# Altium project pulser.PrjPcb
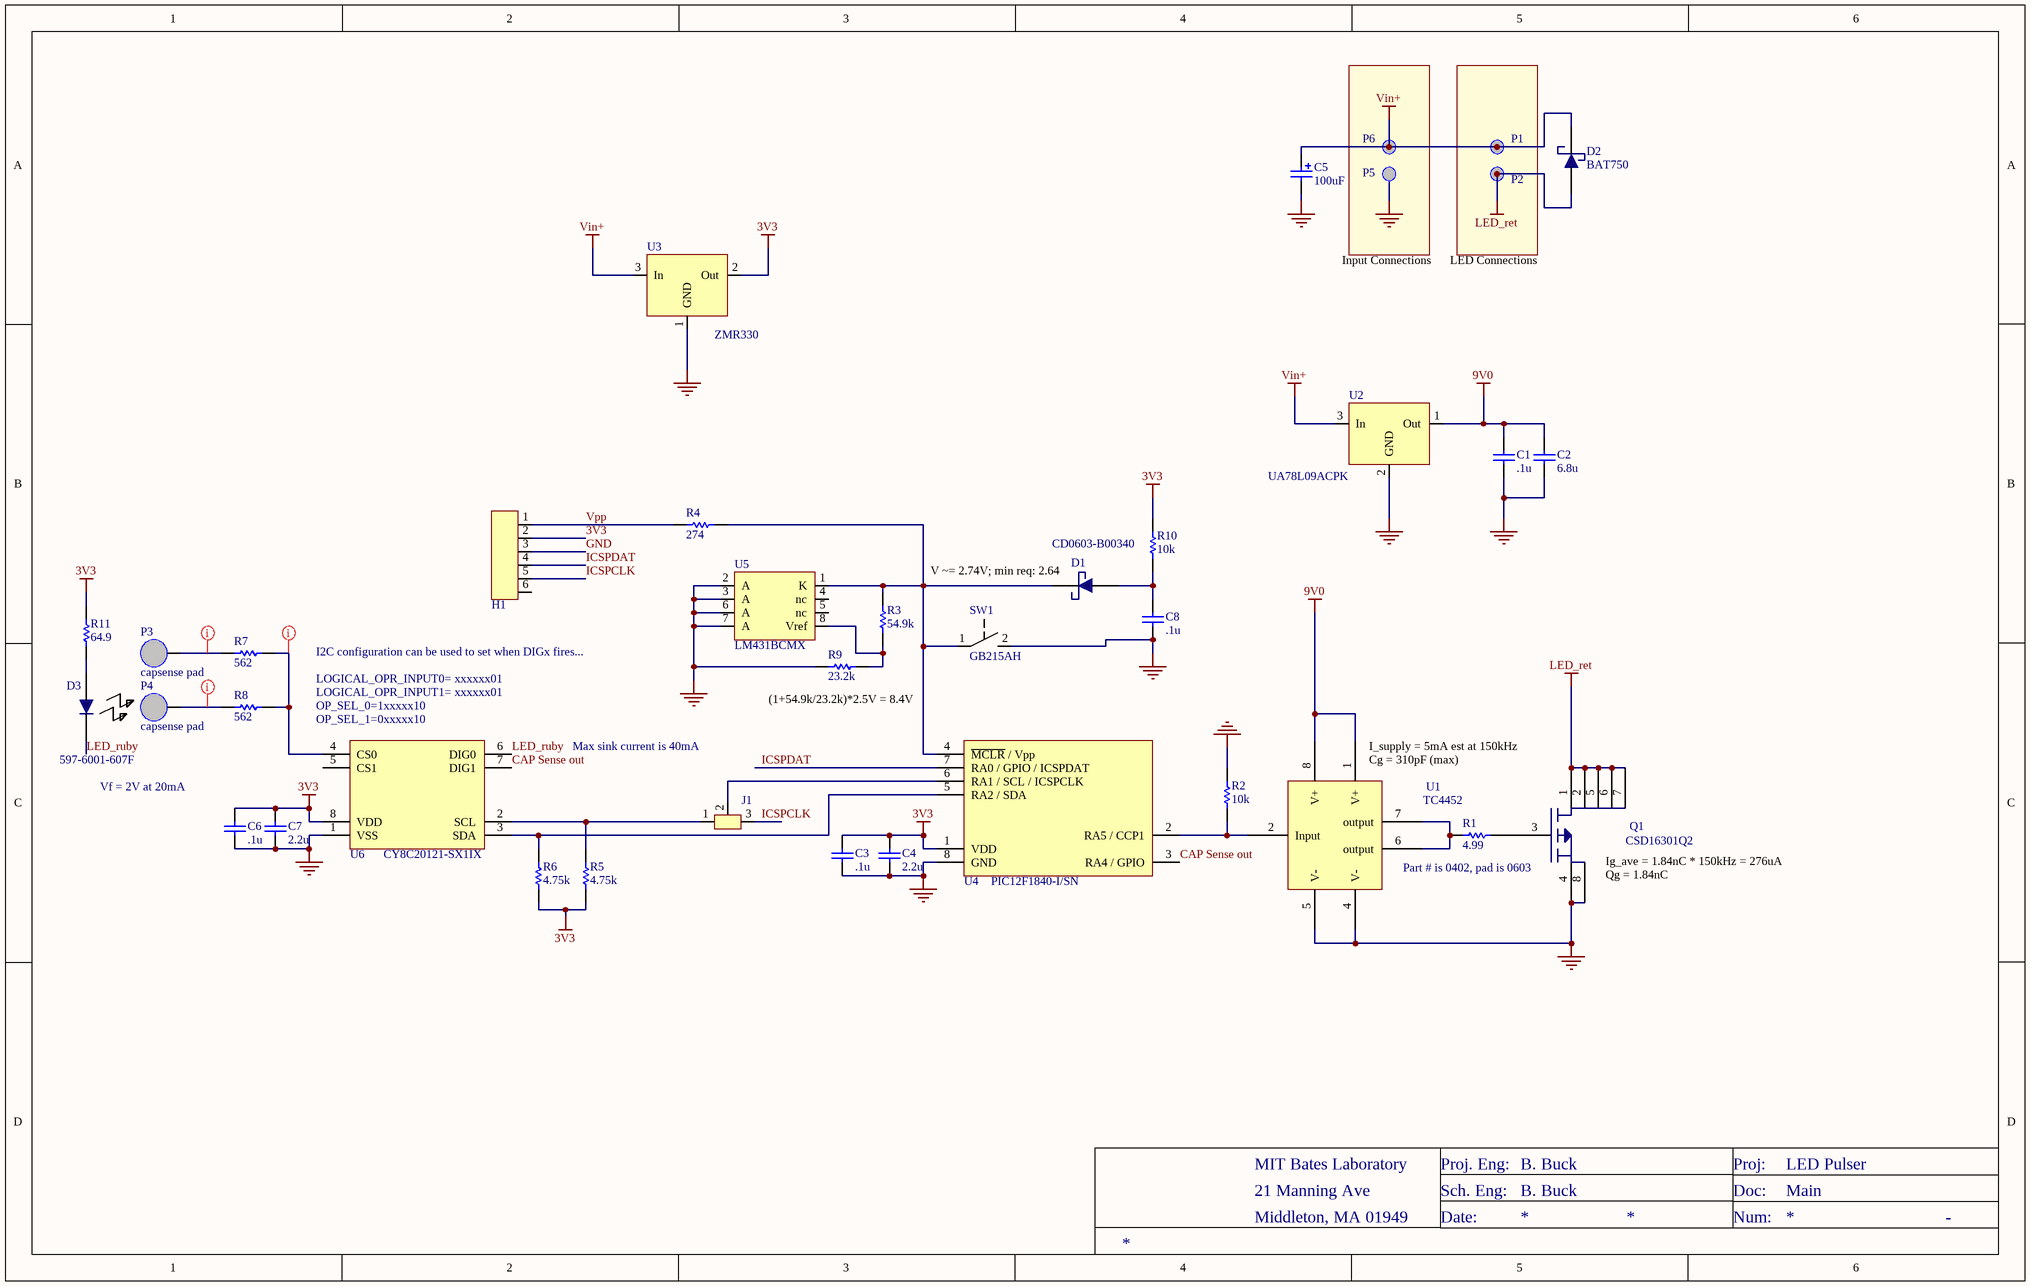
[diagram p0: pulser one pad.SchDoc]
ProjectEngineer: B. Buck; ProjectTitle: LED Pulser
1 sheet, 38 parts. Net scope: global (net labels, ports and power ports of the same name join across sheets).
Board file: pulser one pad.PcbDoc

## Sheet pulser one pad.SchDoc: Main
size 379 x 240 mm; Engineer: B. Buck; Revision: -; SheetNumber: 1; SheetTotal: 1

### Parts
C1  value .1u  [SMD0603]  (hidden comment: Cap)
C2  value 6.8u  [SMD1812]  (hidden comment: Cap)
C3  value .1u  [SMD0603]  (hidden comment: Cap)
C4  value 2.2u  [SMD0603]  (hidden comment: Cap)
C5  value 100uF  [Tant Cap Size D]  (hidden comment: CapPol)
C6  value .1u  [SMD0603]  (hidden comment: Cap)
C7  value 2.2u  [SMD0603]  (hidden comment: Cap)
C8  value .1u  [SMD0603]  (hidden comment: Cap)
D1  CD0603-B00340  [SMD0603 Polarized]
D2  BAT750  [SOT23 - Diodes]
D3  597-6001-607F  [SMD1206 Rev Mount LED]
H1  6 pin header  [6 pin header]  (value not drawn)  (no BOM)
J1  jumper  [3 PIN HEADER]  (value not drawn)  (no BOM)
P1  16AWG Solder Point  [16 AWG Solder Point]  (value not drawn)  (net tie, no BOM)
P2  16AWG Solder Point  [16 AWG Solder Point]  (value not drawn)  (net tie, no BOM)
P3  capsense pad  [CAPSENSE RUBY]  (net tie, no BOM)
P4  capsense pad  [capsense ruby 5.9mm]
P5  16AWG Solder Point  [16 AWG Solder Point]  (value not drawn)  (net tie, no BOM)
P6  16AWG Solder Point  [16 AWG Solder Point]  (value not drawn)  (net tie, no BOM)
Q1  CSD16301Q2  [CSD16301Q2]
R1  value 4.99  [SMD0603]  (hidden comment: Res)
R2  value 10k  [SMD0603]  (hidden comment: Res)
R3  value 54.9k  [SMD0603]  (hidden comment: Res)
R4  value 274  [SMD0603]  (hidden comment: Res)
R5  value 4.75k  [SMD0603]  (hidden comment: Res)
R6  value 4.75k  [SMD0603]  (hidden comment: Res)
R7  value 562  [SMD0603]  (hidden comment: Res)
R8  value 562  [SMD0603]  (hidden comment: Res)
R9  value 23.2k  [SMD0603]  (hidden comment: Res)
R10  value 10k  [SMD0603]  (hidden comment: Res)
R11  value 64.9  [SMD0603]  (hidden comment: Res)
SW1  GB215AH  [GB215AH]
U1  TC4452  [8 PIN SOIC]
U2  UA78L09ACPK  [SOT89-150P350X160-3N]
U3  ZMR330  [SOT23 - Diodes]
U4  PIC12F1840-I/SN  [8 PIN SOIC]
U5  LM431BCMX  [8 PIN SOIC]
U6  PartNumber: CY8C20121-SX1IX  [8 PIN SOIC]  (hidden comment: CY8C20121-SX1I)

### Nets
3V3: C3.2 C4.2 C6.2 C7.2 H1.2 R5.2 R6.2 R10.1 R11.2 U3.2(Out) U4.1(VDD) U6.8(VDD)
9V0: C1.2 C2.2 U1.1(V+) U1.8(V+) U2.1(Out)
GND: C1.1 C2.1 C3.1 C4.1 C5.2 C6.1 C7.1 C8.1 H1.3 P5.1 Q1.4 Q1.8 R2.2 R9.2 SW1.2 U1.4(V-) U1.5(V-) U2.2(GND) U3.1(GND) U4.8(GND) U5.2(A) U5.3(A) U5.6(A) U5.7(A) U6.1(VSS)
LED_ret: D2.2(A) P2.1 Q1.1 Q1.2 Q1.5 Q1.6 Q1.7
Vin+: C5.1 D2.1(K) P1.1 P6.1 U2.3(In) U3.3(In)
CAP Sense out: U4.3(RA4_/_GPIO) U6.7(DIG1)
ICSPCLK: H1.5 J1.3
ICSPDAT: H1.4 U4.7(RA0_/_GPIO_/_ICSPDAT)
LED_ruby: D3.K U6.6(DIG0)
Vpp: H1.1 R4.2
NetC8_2: C8.2 D1.2(A) R10.2
NetD1_1: D1.1(K) R3.2 R4.1 SW1.1 U4.4(~{MCLR}_/_Vpp) U5.1(K)
NetD3_A: D3.A R11.1
NetJ1_1: J1.1 R5.1 U6.2(SCL)
NetJ1_2: J1.2 U4.6(RA1_/_SCL_/_ICSPCLK)
NetP3_1: P3.1 R7.2
NetP4_1: P4.1 R8.2
NetQ1_3: Q1.3 R1.1
NetR1_2: R1.2 U1.6(output) U1.7(output)
NetR2_1: R2.1 U1.2(Input) U4.2(RA5_/_CCP1)
NetR3_1: R3.1 R9.1 U5.8(Vref)
NetR6_1: R6.1 U4.5(RA2_/_SDA) U6.3(SDA)
NetR7_1: R7.1 R8.1 U6.4(CS0)

Not connected (* = marked no-connect by the designer): H1 6; U5 4(nc) 5(nc); U6 5(CS1)

### Layout directives
net class capsense: NetP3_1, NetP4_1, NetR7_1

### Notes on the sheet
- Input Connections
- LED Connections
- (near D1) V ~= 2.74V; min req: 2.64
- I2C configuration can be used to set when DIGx fires...
- LOGICAL_OPR_INPUT0= xxxxxx01
- LOGICAL_OPR_INPUT1= xxxxxx01
- OP_SEL_0=1xxxxx10
- (near U6) OP_SEL_1=0xxxxx10
- Max sink current is 40mA
- (near R9) (1+54.9k/23.2k)*2.5V = 8.4V
- (near U1) Cg = 310pF (max)
- (near U1) I_supply = 5mA est at 150kHz
- Vf = 2V at 20mA
- (near Q1) Part # is 0402, pad is 0603
- (near Q1) Qg = 1.84nC
- (near Q1) Ig_ave = 1.84nC * 150kHz = 276uA
- MIT Bates Laboratory
- Proj. Eng:
- Proj:
- 21 Manning Ave
- Middleton, MA 01949
- Sch. Eng:
- Date:
- Doc:
- Num:

### Library data of the parts
C1 C3 C6 C8 = Cap: Capacitor; PartNumber: 250R14W104KV4T; Manufacturer: Johanson Dielectrics
C2 = Cap: Capacitor; PartNumber: C4532X5R1H685K250KA; Manufacturer: TDK
C4 C7 = Cap: Capacitor; PartNumber: C1608X5R1V225K080AC; Manufacturer: TDK
C5 = CapPol: Capacitor; PartNumber: T495X476K035ATE300; Manufacturer: Kemet
D1 = CD0603-B00340: Schottky Diode; Manufacturer: Bourns; PartNumber: CD0603-B00340
D2 = BAT750: Schottky Diode high current; Manufacturer: Diodes / Zetex; PartNumber: BAT750
D3 = 1206 reverse mount LED: Reverse Mount 1206 LED; Manufacturer: Dialight; PartNumber: 597-6001-607F
J1 = jumper: Three Pin Jumper
P3 P4 = capsense pad 1: circular capsense pad
Q1 = CSD16301Q2: N Ch. MOSFET; Manufacturer: Texas Instruments; PartNumber: CSD16301Q2
R1 = Res: Resistor; PartNumber: CRCW04024R99FK; Manufacturer: Vishay / Dale
R2 R10 = Res: Resistor; PartNumber: CRCW060310K0FK; Manufacturer: Vishay / Dale
R3 = Res: Resistor; PartNumber: CRCW060354K9FK; Manufacturer: Vishay / Dale
R4 = Res: Resistor; PartNumber: CRCW0603274RFK; Manufacturer: Vishay / Dale
R5 R6 = Res: Resistor; PartNumber: CRCW06034K75FK; Manufacturer: Vishay / Dale
R7 R8 = Res: Resistor; PartNumber: CRCW0603562RFK; Manufacturer: Vishay / Dale
R9 = Res: Resistor; PartNumber: CRCW060323K2FK; Manufacturer: Vishay / Dale
R11 = Res: Resistor; PartNumber: CRCW060364R9FK; Manufacturer: Vishay / Dale
SW1 = GB215AH: SPST Normally Open Switch; Manufacturer: NKK Switches; PartNumber: GB215AH
U1 = TC4452: MOSFET Gate Driver, Low Side, Non Inverting 13A max; Manufacturer: Microchip; PartNumber: TC4452VOA
U2 = UA78L09ACPK: 9V linear fixed regulator, TI Part; Manufacturer: Texas Instruments; PartNumber: UA78L09ACPK
U3 = ZMR330: Diodes 3.3V LDO regulator, 50mA; PartNumber: ZMR330FTA; Manufacturer: Diodes
U4 = PIC12F1840-I/SN: 8 Bit RISC uController; Manufacturer: Microchip; PartNumber: PIC12F1840-I/SN
U5 = LM431BCMX: Adjustable Voltage Reference; Manufacturer: Fairchild Semiconductor; PartNumber: LM431ACMX
U6 = CY8C20121-SX1I: Capsense Module, 2 button; Manufacturer: Cypress